# EAGLE design compteur_modifie_essence (EAGLE 9.0.0)
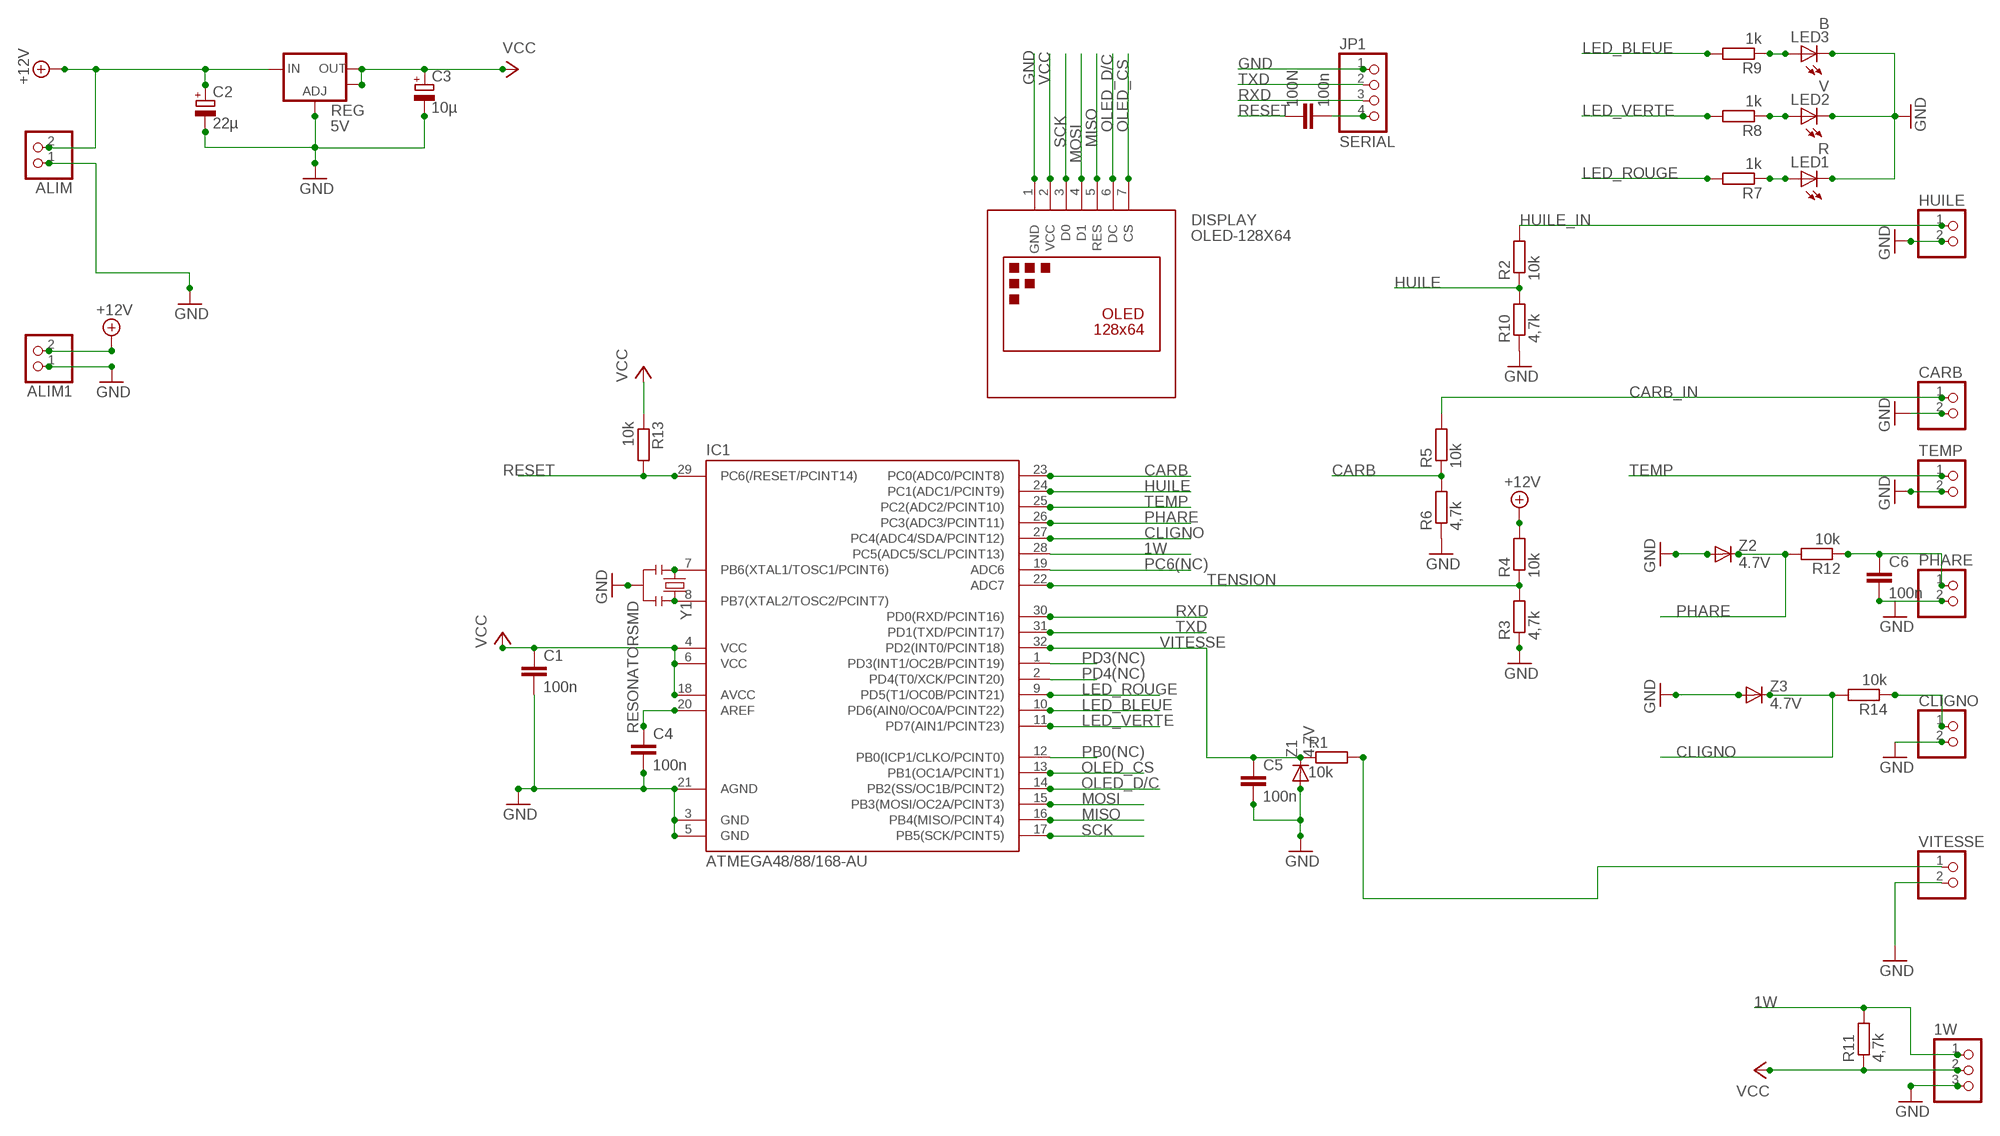
[diagram p0: schematic, sheet 1]

## Parts
1W  PINHD-1X3CB  [1X03-CLEANBIG]
100N  100n  C-EUC1206  [C1206]
ALIM  PINHD-1X2  [1X02]
ALIM1  PINHD-1X2  [1X02]
C1  100n  C-EUC1206  [C1206]
C2  22µ  CPOL-EUSMCD  [SMC_D]
C3  10µ  CPOL-EUSMCC  [SMC_C]
C4  100n  C-EUC1206  [C1206]
C5  100n  C-EUC1206  [C1206]
C6  100n  C-EUC1206  [C1206]
CARB  PINHD-1X2  [1X02]
CLIGNO  PINHD-1X2  [1X02]
DISPLAY  OLED-128X64  DISPLAY-OLED-128X64  [DISPLAY-OLED-128X64]
HUILE  PINHD-1X2  [1X02]
IC1  ATMEGA48/88/168-AU  [TQFP32-08]
JP1  SERIAL  HEADER-1X4ROUND  [1X04_ROUND]
LED1  R  LED5MM  [LED5MM]
LED2  V  LED5MM  [LED5MM]
LED3  B  LED5MM  [LED5MM]
PHARE  PINHD-1X2  [1X02]
R1  10k  R-EU_R1206  [R1206]
R2  10k  R-EU_R1206  [R1206]
R3  4,7k  R-EU_R1206  [R1206]
R4  10k  R-EU_R1206  [R1206]
R5  10k  R-EU_R1206  [R1206]
R6  4,7k  R-EU_R1206  [R1206]
R7  1k  R-EU_R1206  [R1206]
R8  1k  R-EU_R1206  [R1206]
R9  1k  R-EU_R1206  [R1206]
R10  4,7k  R-EU_R1206  [R1206]
R11  4,7k  R-EU_R1206  [R1206]
R12  10k  R-EU_R1206  [R1206]
R13  10k  R-EU_R1206  [R1206]
R14  10k  R-EU_R1206  [R1206]
REG  5V  V_REG_LM1117SOT223  [SOT223]
TEMP  PINHD-1X2  [1X02]
VITESSE  PINHD-1X2  [1X02]
Y1  RESONATORSMD  [RESONATOR-SMD]
Z1  4.7V  DIODE-SOD123  [SOD123]
Z2  4.7V  DIODE-SOD123  [SOD123]
Z3  4.7V  DIODE-SOD123  [SOD123]

## Nets
1W: 1W.1 IC1.28(PC5(ADC5/SCL/PCINT13)) R11.2
+12V: ALIM1.2 ALIM.2 C2.+ R4.2 REG.3(IN)
AREF: C4.1 IC1.20(AREF)
CARB: IC1.23(PC0(ADC0/PCINT8)) R5.1 R6.2
CARB_IN: CARB.1 R5.2
CLIGNO: IC1.27(PC4(ADC4/SDA/PCINT12)) R14.2 Z3.C
GND: 1W.3 ALIM1.1 ALIM.1 C1.2 C2.- C3.- C4.2 C5.2 C6.2 CARB.2 CLIGNO.2 DISPLAY.1(GND) HUILE.2 IC1.3(GND) IC1.5(GND) IC1.21(AGND) JP1.1 LED1.K(C) LED2.K(C) LED3.K(C) PHARE.2 R3.1 R6.1 R10.1 REG.1(ADJ) TEMP.2 VITESSE.2 Y1.2 Z1.A Z2.A Z3.A
HUILE: IC1.24(PC1(ADC1/PCINT9)) R2.1 R10.2
HUILE_IN: HUILE.1 R2.2
LED_BLEUE: IC1.10(PD6(AIN0/OC0A/PCINT22)) R9.2
LED_ROUGE: IC1.9(PD5(T1/OC0B/PCINT21)) R7.2
LED_VERTE: IC1.11(PD7(AIN1/PCINT23)) R8.2
MISO: DISPLAY.5(RES) IC1.16(PB4(MISO/PCINT4))
MOSI: DISPLAY.4(D1) IC1.15(PB3(MOSI/OC2A/PCINT3))
N$4: LED1.A R7.1
N$7: CLIGNO.1 R14.1
OLED_CS: DISPLAY.7(CS) IC1.13(PB1(OC1A/PCINT1))
OLED_D/C: DISPLAY.6(DC) IC1.14(PB2(SS/OC1B/PCINT2))
PB0(NC): IC1.12(PB0(ICP1/CLKO/PCINT0))
PC6(NC): IC1.19(ADC6)
PD3(NC): IC1.1(PD3(INT1/OC2B/PCINT19))
PD4(NC): IC1.2(PD4(T0/XCK/PCINT20))
PHARE: IC1.26(PC3(ADC3/PCINT11)) R12.2 Z2.C
PHARE_IN: C6.1 PHARE.1 R12.1
R8: LED2.A R8.1
R9: LED3.A R9.1
RESET: 100N.1 IC1.29(PC6(/RESET/PCINT14)) R13.2
RST: 100N.2 JP1.4
RXD: IC1.30(PD0(RXD/PCINT16)) JP1.3
SCK: DISPLAY.3(D0) IC1.17(PB5(SCK/PCINT5))
TEMP: IC1.25(PC2(ADC2/PCINT10)) TEMP.1
TENSION: IC1.22(ADC7) R3.2 R4.1
TXD: IC1.31(PD1(TXD/PCINT17)) JP1.2
VCC: 1W.2 C1.1 C3.+ DISPLAY.2(VCC) IC1.4(VCC) IC1.6(VCC) IC1.18(AVCC) R11.1 R13.1 REG.2(OUT) REG.4(OUT)
VITESS_IN: R1.2 VITESSE.1
VITESSE: C5.1 IC1.32(PD2(INT0/PCINT18)) R1.1 Z1.C
XTAL1: IC1.7(PB6(XTAL1/TOSC1/PCINT6)) Y1.1
XTAL2: IC1.8(PB7(XTAL2/TOSC2/PCINT7)) Y1.3

## Library data of the parts
1W = ADAFRUITmodified:PINHD-1X3: PIN HEADER
100N C1 C4-C6 = rcl:C-EU: CAPACITOR, European symbol
ALIM ALIM1 CARB CLIGNO HUILE PHARE TEMP VITESSE = pinhead:PINHD-1X2: PIN HEADER
C2 = resistor:CPOL-EU: POLARIZED CAPACITOR, European symbol
C3 = rcl:CPOL-EU: POLARIZED CAPACITOR, European symbol
DISPLAY = diy-modules:DISPLAY-OLED-128X64: 128x64 Dot Matrix OLED Module based on SSD1306 chip Variant with SPI interface More details available here: http://www.instructables.com/id/How-to-use-OLED-display-arduino-module/ SSD1306 datasheet: https://cdn-shop.adafruit.com/datasheets/SSD1306.pdf Click here to find device on ebay.com <http://www.ebay.com/sch/oled+display+128x64> Note: There are two variants: I2C and SPI. Search for the proper version.
IC1 = atmega8:ATMEGA48/88/168
JP1 = microbuilder:HEADER-1X4: PIN HEADER
LED1-LED3 = Base_CC:LED: LED OSRAM: - CHIPLED LG R971, LG N971, LY N971, LG Q971, LY Q971, LO R971, LY R971 LH N974, LH R974 LS Q976, LO Q976, LY Q976 LO Q996 - Hyper CHIPLED LW Q18S LB Q993, LB Q99A, LB R99A - SideLED LS A670, LO A670, LY A670, LG A670, LP A670 LB A673, LV A673, LT A673, LW A673 LH A674 LY A675 LS A676, LA A676, LO A676, LY A676, LW A676 LS A679, LY A679, LG A679 - Hyper Micro SIDELED® LS Y876, LA Y876, LO Y876, LY Y876 LT Y87S - SmartLED LW L88C, LW L88S LB L89C, LB L89S, LG L890 LS L89K, LO L89K, LY L89K LS L896, LA L896, LO L896, LY L896 - TOPLED LS T670, LO T670, LY T670, LG T670, LP T670 LSG T670, LSP T670, LSY T670, LOP T670, LYG T670 LG T671, LOG T671, LSG T671 LB T673, LV T673, LT T673, LW T673 LH T674 LS T676, LA T676, LO T676, LY T676, LB T676, LH T676, LSB T676, LW T676 LB T67C, LV T67C, LT T67C, LS T67K, LO T67K, LY T67K, LW E67C LS E67B, LA E67B, LO E67B, LY E67B, LB E67C, LV E67C, LT E67C LW T67C LS T679, LY T679, LG T679 LS T770, LO T770, LY T770, LG T770, LP T770 LB T773, LV T773, LT T773, LW T773 LH T774 LS E675, LA E675, LY E675, LS T675 LS T776, LA T776, LO T776, LY T776, LB T776 LHGB T686 LT T68C, LB T68C - Hyper Mini TOPLED® LB M676 - Mini TOPLED Santana® LG M470 LS M47K, LO M47K, LY M47K Source: http://www.osram.convergy.de LUXEON: - LUMILED® LXK2-PW12-R00, LXK2-PW12-S00, LXK2-PW14-U00, LXK2-PW14-V00 LXK2-PM12-R00, LXK2-PM12-S00, LXK2-PM14-U00 LXK2-PE12-Q00, LXK2-PE12-R00, LXK2-PE12-S00, LXK2-PE14-T00, LXK2-PE14-U00 LXK2-PB12-K00, LXK2-PB12-L00, LXK2-PB12-M00, LXK2-PB14-N00, LXK2-PB14-P00, LXK2-PB14-Q00 LXK2-PR12-L00, LXK2-PR12-M00, LXK2-PR14-Q00, LXK2-PR14-R00 LXK2-PD12-Q00, LXK2-PD12-R00, LXK2-PD12-S00 LXK2-PH12-R00, LXK2-PH12-S00 LXK2-PL12-P00, LXK2-PL12-Q00, LXK2-PL12-R00 Source: www.luxeon.com KINGBRIGHT: KA-3528ASYC Source: www.kingbright.com
R1-R14 = rcl:R-EU_: RESISTOR, European symbol
REG = SparkFun:V_REG_LM1117: Voltage Regulator LM1117 Standard adjustable voltage regulator but in SMD form. Spark Fun Electronics SKU : COM-00595
Y1 = SparkFun:RESONATOR: Resonator Small SMD resonator. This is the itty bitty 10/20MHz resonators with built in caps. CSTCE10M0G55 and CSTCE20M0V53. Footprint has been reviewed closely but hasn't been tested yet.
Z1-Z3 = diode:DIODE-: DIODE

## Board
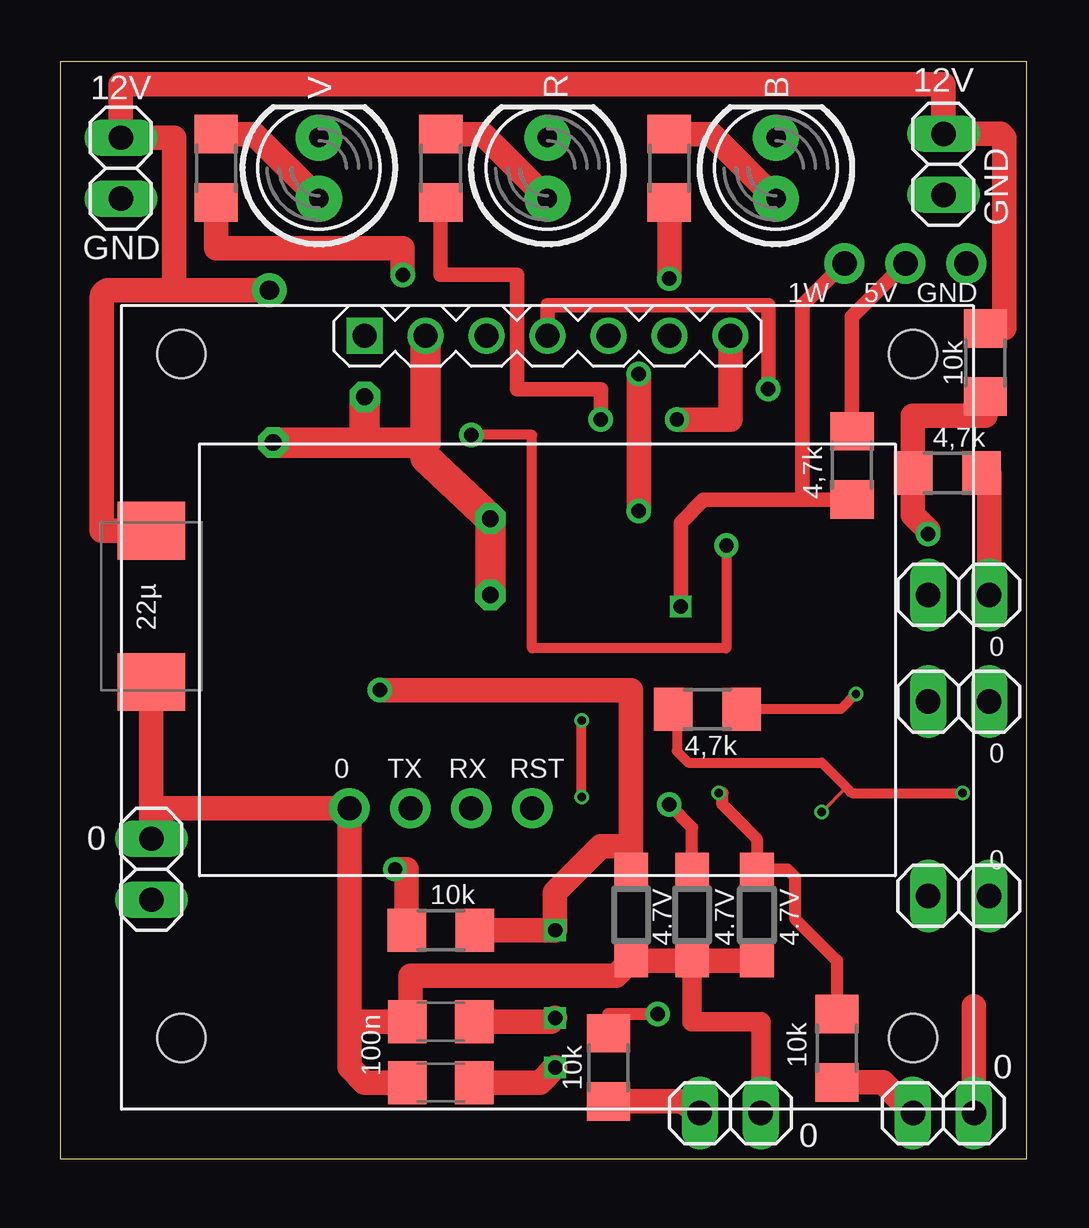
[diagram p1: board, top side]
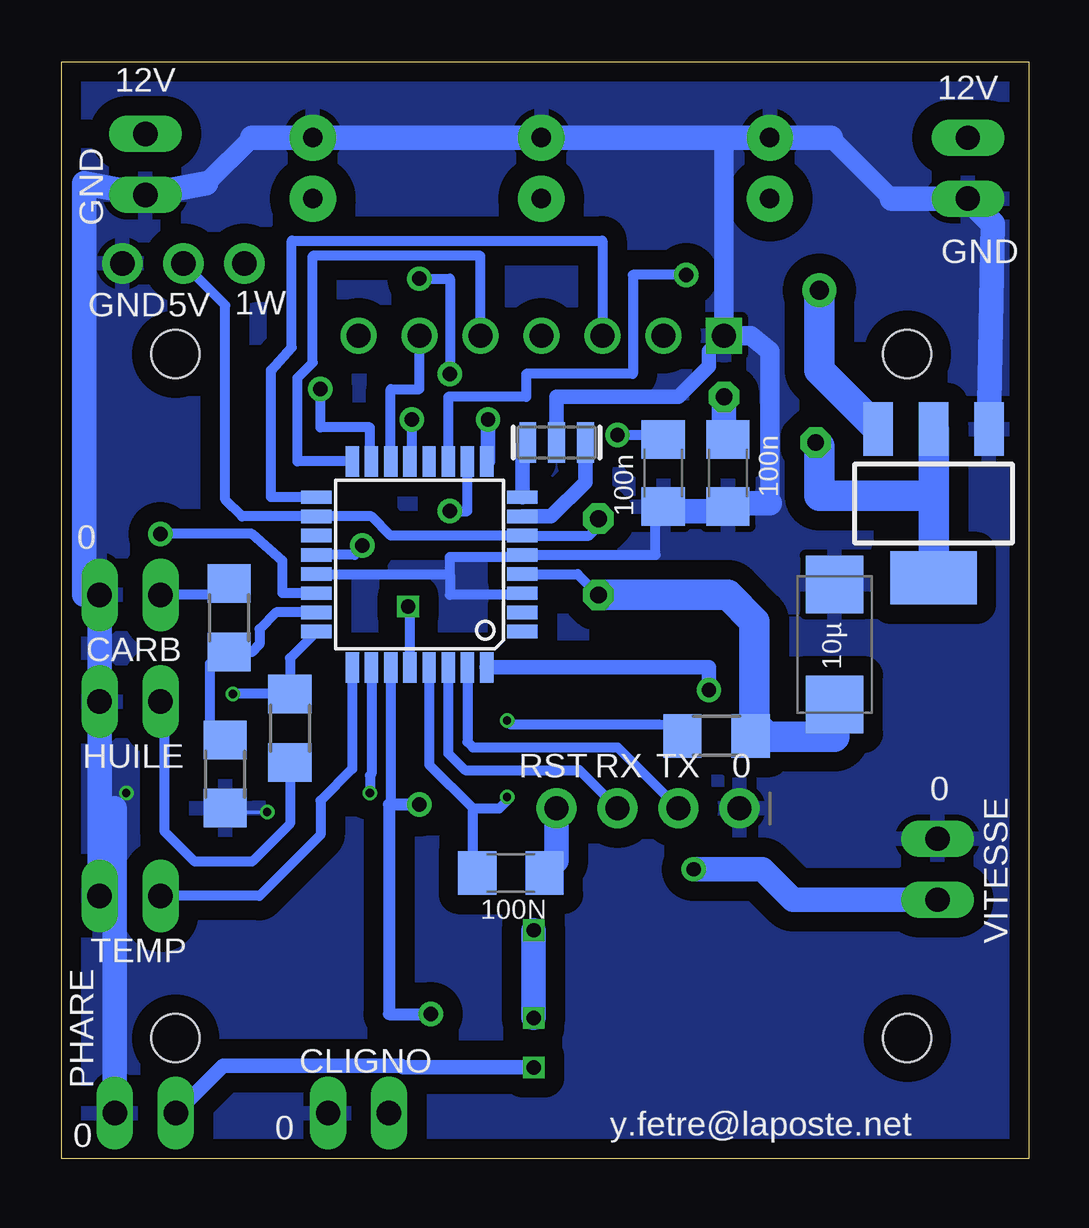
[diagram p2: board, bottom side, seen from below]

Size 40.31 x 45.71 mm. Coordinates in mm from the lower left corner, seen from the top.
Outline: 0,0 40.31,0 40.31,45.71 0,45.71 0,0
Copper layers (1*16): Top 0.035559375mm / dielectric 1.6mm / Bottom 0.035559375mm
Design rules "oshpark-2layer": minimum track width 6mil, minimum drill 10mil, track to track 6mil, track to pad 6mil, pad to pad 6mil, via to via 6mil, smd to smd 6mil, copper to edge 15mil, drill to drill 6mil, minimum pad ring 5mil, minimum via ring 5mil, stop-mask expansion 2.5mil, vias tented up to drill 0mil, thermal gap 10mil

### Footprints (pad centres in the part's own frame; a part is rotated, then mirrored left to right if it is on the bottom)
1X03-CLEANBIG = drill 1.016 pad 1.676: 1 -2.54,0; 2 0,0; 3 2.54,0
C1206 = smd 1.6 x 1.8: 1 -1.4,0; 2 1.4,0
1X02 = drill 1.016 long: 1 -1.27,0; 2 1.27,0
SMC_D = smd 2.4 x 2.8: + -3.15,0; - 3.15,0
SMC_C = smd 2.4 x 2.4: + -2.5,0; - 2.5,0
DISPLAY-OLED-128X64 = drill 1 square: 1 -7.62,12.7 | drill 1: 2 -5.08,12.7; 3 -2.54,12.7; 4 0,12.7; 5 2.54,12.7; 6 5.08,12.7; 7 7.62,12.7 | hole 2: -15.25,11.938; 15.25,11.938; 15.25,-16.562; -15.25,-16.562
TQFP32-08 = smd 1.27 x 0.559: 1 -4.293,2.8; 2 -4.293,2; 3 -4.293,1.2; 4 -4.293,0.4; 5 -4.293,-0.4; 6 -4.293,-1.2; 7 -4.293,-2; 8 -4.293,-2.8; 17 4.293,-2.8; 18 4.293,-2; 19 4.293,-1.2; 20 4.293,-0.4; 21 4.293,0.4; 22 4.293,1.2; 23 4.293,2; 24 4.293,2.8 | smd 0.559 x 1.27: 9 -2.8,-4.293; 10 -2,-4.293; 11 -1.2,-4.293; 12 -0.4,-4.293; 13 0.4,-4.293; 14 1.2,-4.293; 15 2,-4.293; 16 2.8,-4.293; 25 2.8,4.293; 26 2,4.293; 27 1.2,4.293; 28 0.4,4.293; 29 -0.4,4.293; 30 -1.2,4.293; 31 -2,4.293; 32 -2.8,4.293
1X04_ROUND = drill 1 pad 1.676: 1 -3.81,0; 2 -1.27,0; 3 1.27,0; 4 3.81,0
LED5MM = drill 0.813 pad 1.93: A -1.27,0; K 1.27,0
R1206 = smd 1.6 x 1.803: 1 -1.422,0; 2 1.422,0
SOT223 = smd 1.219 x 2.235: 1 -2.311,-3.099; 2 0,-3.099; 3 2.311,-3.099 | smd 3.6 x 2.2: 4 0,3.099
RESONATOR-SMD = smd 0.7 x 1.7: 1 -1.2,0; 2 0,0; 3 1.2,0
SOD123 = smd 1.4 x 1.4: A 1.9,0; C -1.9,0

### Placement (x,y rotation side)
1W  35.24,37.31 0 top
100N  21.59,11.91 0 bottom
ALIM  2.54,41.27 90 top
ALIM1  36.83,41.43 90 top
C1  12.54,28.58 270 bottom
C2  3.81,23.02 270 top
C3  8.1,21.43 90 bottom
C4  15.24,28.58 270 bottom
C5  15.87,5.72 180 top
C6  15.87,3.18 180 top
CARB  37.47,23.49 0 top
CLIGNO  27.94,1.91 0 top
DISPLAY  20.32,21.59 0 top
HUILE  37.47,19.05 0 top
IC1  25.4,24.77 180 bottom
JP1  15.87,14.61 180 bottom
LED1  20.32,41.27 90 top
LED2  10.79,41.27 90 top
LED3  29.84,41.27 90 top
PHARE  36.83,1.91 0 top
R1  15.87,9.52 180 top
R2  30.8,17.94 270 bottom
R3  36.99,28.58 180 top
R4  38.58,33.18 90 top
R5  33.34,22.54 90 bottom
R6  33.5,16.03 90 bottom
R7  15.87,41.27 270 top
R8  6.51,41.27 270 top
R9  25.4,41.27 270 top
R10  26.99,18.73 0 top
R11  33.02,28.89 270 top
R12  32.39,4.6 90 top
R13  13.02,17.62 180 bottom
R14  22.86,3.81 90 top
REG  3.97,27.3 180 bottom
TEMP  37.47,10.95 0 top
VITESSE  3.81,12.06 90 top
Y1  19.68,29.85 180 bottom
Z1  23.81,10.16 270 top
Z2  29.05,10.16 270 top
Z3  26.35,10.16 270 top

### Tracks (layer width: path | path; a pad name or v marks a point on that pad's centre or on a via)
1W  (via drill 0.6)
  Top 0.61: 1W.1 30.96,35.56 30.96,27.46 | R11.2 33.34,27.36 33.24,27.46 30.96,27.46 | v25.88,23.02 25.88,26.51 26.83,27.46 30.96,27.46
  Bottom 0.406: IC1.28 25.8,23.1 25.88,23.18 v25.88,23.02
+12V  (via drill 0.8 pad 1.42)
  Top 1.016: 4.76,36.2 4.76,42.54 ALIM.2 2.54,44.77 36.83,44.77 ALIM1.2 39.21,42.7 39.37,42.54 39.37,36.83 39.36,34.6 R4.2 | C2.+ 1.75,26.17 1.75,35.88 arc-90 2.06,36.2 4.76,36.2 | 4.76,36.2 v8.73,36.2
  Bottom 0.813: REG.3 6.35,30.48 6.35,30.47 REG.3
  Bottom 1.27: 6.35,30.48 8.73,32.86 v8.73,36.2
AREF  (via drill 0.6 pad 1.02)
  Top 0.406: v27.78,25.56 27.78,21.27 19.68,21.27 19.68,30.16 v17.14,30.16
  Bottom 0.305: 16.06,30.16 C4.1 15.87,30.16
  Bottom 0.406: IC1.20 28.1,25.16 v27.78,25.56 | v17.14,30.16 15.87,30.16
CARB
  Bottom 0.406: IC1.23 31.37,22.77 32.07,22.07 32.07,21.43 32.39,21.11 R5.1 | R5.1 33.5,20.96 | R6.2 33.66,17.62 34.13,17.62 34.13,20.64 33.65,21.12 R5.1
CARB_IN
  Bottom 0.406: R5.2 33.81,23.49 CARB.1
CLIGNO  (via drill 0.6 pad 1.02)
  Top 0.305: 22.86,5.4 R14.2
  Top 0.508: v24.92,6.03 22.86,6.03 22.86,5.4 | Z3.C 26.35,13.81 v25.4,14.76
  Bottom 0.406: IC1.27 26.6,14.83 26.67,14.76
  Bottom 0.508: v25.4,14.76 26.67,14.76 26.67,6.03 v24.92,6.03
GND  (via drill 0.35)
  Top 0.152: 32.78,15.48 v31.75,14.45
  Top 0.406: 14.45,5.69 C5.2 14.61,5.84 | R10.1 25.72,18.58 25.72,16.99 26.19,16.51 31.75,16.51 32.78,15.48 33.02,15.24 v37.62,15.24
  Top 0.813: Z3.A 26.35,5.72 29.21,5.72 CLIGNO.2 | 23.83,8.28 Z1.A
  Top 1.016: R3.1 38.73,28.57 CARB.2 | VITESSE.2 3.81,14.61 | 3.81,14.61 JP1.1 12.07,5.72 | 12.07,5.72 C5.2 | 14.61,5.84 14.61,7.62 23.18,7.62 23.83,8.28 | PHARE.2 38.1,6.35 | 3.81,14.61 C2.- | 12.07,5.72 12.07,3.81 12.7,3.18 C6.2 | Z1.A Z3.A Z2.A
  Bottom 0.152: v31.75,14.45 33.33,14.45 R6.1
  Bottom 0.305: IC1.3 21.18,23.49 | 21.11,25.08 IC1.5 | C4.2 15.56,26.99 | 12.7,26.99 C1.2 12.57,27.3
  Bottom 0.406: 21.18,23.49 24.13,23.49 24.13,24.34 | 24.13,24.34 24.13,25.08 21.11,25.08 | IC1.5 15.56,25.16 15.56,26.99 | IC1.21 24.15,24.37 24.13,24.34
  Bottom 0.61: Y1.2 19.68,31.75 14.61,31.75 13.33,33.02 13.33,33.65 DISPLAY.1
  Bottom 0.813: TEMP.2 38.1,14.61 | 32.39,42.54 34.29,40.64 | 8.25,42.54 5.71,40.01 | 39.37,23.49 CARB.2 | 12.7,42.54 DISPLAY.1 11.59,34.29 10.79,33.65 10.79,27.3
  Bottom 1.016: CARB.2 HUILE.2 TEMP.2 | 38.1,14.61 PHARE.2 38.1,0.95 | REG.1 1.5,38.96 ALIM.1 5.71,40.01 | 32.39,42.54 LED3.K LED1.K 12.7,42.54 LED2.K 8.25,42.54 | 34.29,40.64 ALIM1.1 39.37,40.64 39.37,23.49 | 15.56,26.99 12.7,26.99 | 10.79,27.3 12.57,27.3
  pour Bottom (isolate 0.813): 0.32,45.24 39.85,45.24 39.85,0.48 0.32,0.48 0.32,45.09
HUILE  (via drill 0.35)
  Top 0.406: v33.18,19.37 32.54,18.73 R10.2
  Bottom 0.406: IC1.24 30.8,20.86 R2.1 v33.18,19.37
HUILE_IN
  Bottom 0.152: HUILE.1 36.04,18.89
  Bottom 0.406: HUILE.1 36.2,18.26 35.88,17.94 | R2.2 30.8,13.97 32.39,12.38 34.77,12.38 36.04,13.65 36.04,18.89
LED_BLEUE  (via drill 0.6 pad 1.02)
  Top 1.016: R9.2 v25.4,36.67 | v24.13,32.7 v24.13,26.99
  Bottom 0.406: v25.4,36.67 24.13,36.67 v24.13,32.7 | v24.13,26.99 23.4,26.99 IC1.10
LED_ROUGE  (via drill 0.6 pad 1.02)
  Top 0.61: v22.54,30.8 22.54,32.07 19.05,32.07 19.05,36.83 15.87,36.83 R7.2 15.87,40.01
  Bottom 0.305: IC1.9 22.54,29.06
  Bottom 0.61: 22.54,29.06 v22.54,30.8
LED_VERTE  (via drill 0.6 pad 1.02)
  Top 1.016: R8.2 6.51,37.94 14.29,37.94 v14.29,36.83
  Bottom 0.406: v14.29,36.83 16.51,36.83 16.51,32.7 20.96,32.7 20.96,31.75 24.2,31.75 IC1.11
MISO
  Bottom 0.406: DISPLAY.5 22.86,37.62 29.84,37.62 29.84,33.18 30.48,32.54 30.48,29.06 IC1.16
MOSI  (via drill 0.6 pad 1.02)
  Top 0.61: DISPLAY.4 20.32,35.56 29.53,35.56 v29.53,32.07
  Bottom 0.305: IC1.15 27.46,29.06
  Bottom 0.406: v29.53,32.07 29.53,30.48 27.46,30.48 27.46,29.06
N$4
  Top 1.016: R7.1 17.63,42.7 LED1.A
N$7
  Top 1.016: CLIGNO.1 25.88,2.39 R14.1
OLED_CS  (via drill 0.6 pad 1.02)
  Top 1.016: v25.72,30.8 27.94,30.8 DISPLAY.7
  Bottom 0.305: IC1.13 25.72,29.06
  Bottom 0.406: 25.72,29.06 v25.72,30.8
OLED_D/C
  Bottom 0.406: IC1.14 26.6,32.07 25.4,32.07 DISPLAY.6
PHARE  (via drill 0.35)
  Top 0.406: 27.62,15.24 v27.47,15.24
  Top 0.508: R12.2 32.39,8.26 30.64,10.01 30.64,11.75 30.33,12.06 Z2.C 29.05,13.34 27.62,14.76 27.62,15.24
  Bottom 0.406: v27.47,15.24 27.47,15.97 27.4,16.03 IC1.26
PHARE_IN  (via drill 0.6)
  Top 1.016: PHARE.1 34.3,3.18 R12.1 | v20.64,3.81 20,3.18 C6.1
  Bottom 0.61: v20.64,3.81 26.09,3.81 26.16,3.89 33.58,3.89 PHARE.1
R8
  Top 1.016: R8.1 8.1,42.7 LED2.A
R9
  Top 1.016: R9.1 27.15,42.7 LED3.A
RESET  (via drill 0.35)
  Top 0.406: v21.75,15.08 v21.75,18.26
  Bottom 0.406: 23.18,14.61 25,16.43 IC1.29 | 23.18,12.09 23.18,14.61 | 23.18,14.61 22.07,14.61 21.75,14.92 v21.75,15.08 | v21.75,18.26 21.59,18.1 15.4,18.1 14.76,18.09 R13.2
  Bottom 1.016: 100N.1 23.18,12.09
RST
  Bottom 1.016: 100N.2 19.68,12.41 JP1.4
RXD
  Bottom 0.406: IC1.30 24.2,16.9 23.5,16.19 18.73,16.19 JP1.3
SCK
  Bottom 0.406: IC1.17 31.59,27.56 31.59,32.86 30.72,33.81 30.72,38.26 17.78,38.26 DISPLAY.3
TEMP
  Bottom 0.305: 28.26,20.47 IC1.25
  Bottom 0.406: IC1.25 28.2,16.25 29.53,14.92 29.53,13.49 32.07,10.95 TEMP.1
TENSION  (via drill 0.6 pad 1.02)
  Top 0.406: 35.56,29.36 R3.2 35.56,28.57 | 36.2,26.19 v36.2,26.04
  Top 1.016: R4.1 38.58,30.96 35.56,30.96 35.56,29.36 | 35.56,28.57 35.56,26.83 36.2,26.19
  Bottom 0.406: v36.2,26.04 32.39,26.04 31.11,24.92 31.11,23.56 IC1.22
TXD
  Bottom 0.406: IC1.31 23.4,17.37 23.18,17.15 17.14,17.15 JP1.2
VCC  (via drill 0.7 pad 1.27)
  Top 0.61: R11.1 33.02,35.08 1W.2
  Top 0.813: 15.24,29.85 15.24,29.21
  Top 1.27: v17.94,23.49 v17.94,26.67 15.24,29.21 | v8.89,29.85 12.7,29.85 | 12.7,29.85 15.24,29.85 DISPLAY.2 | v12.7,31.75 12.7,29.85
  Bottom 0.152: R13.1 10.95,17.62 10.92,17.59
  Bottom 0.305: 8.81,29.76 v8.89,29.85
  Bottom 0.406: IC1.4 18.81,24.37 v17.94,23.49 | IC1.18 27.4,26.77 26.6,25.97 IC1.6 18.33,25.97 17.94,26.35 v17.94,26.67 | 29.76,26.83 IC1.18 | 1W.2 33.5,35.56 33.5,27.46 32.8,26.77 IC1.18
  Bottom 0.813: C1.1 12.7,29.98 | 3.97,27.46 4.13,27.62
  Bottom 1.016: 12.7,29.98 v12.7,31.75
  Bottom 1.27: C3.+ 8.1,17.59 10.92,17.59 11.43,18.1 11.43,22.38 12.54,23.49 v17.94,23.49 | REG.4 3.97,27.46 REG.2 | 4.13,27.62 8.73,27.62 8.73,29.69 v8.89,29.85
VITESS_IN  (via drill 0.6 pad 1.02)
  Top 1.016: R1.2 14.45,12.06 v13.97,12.06
  Bottom 1.016: v13.97,12.06 11.11,12.06 9.84,10.8 VITESSE.1
VITESSE  (via drill 0.6, 0.6 pad 1.02)
  Top 0.61: 23.65,13.02 Z1.C
  Top 1.016: Z1.C 23.81,19.53 v13.33,19.53 | v20.64,5.87 20.48,5.72 C5.1 | R1.1 v20.64,9.52 20.64,11.11 22.54,13.02 23.65,13.02
  Bottom 0.61: IC1.32 13.33,20.47 v13.33,19.53
  Bottom 1.016: v20.64,5.87 v20.64,9.52
XTAL1
  Bottom 0.61: IC1.7 19.91,26.77 18.48,28.19 Y1.1
XTAL2
  Bottom 0.305: 21.11,29.69 20.96,29.85 Y1.3
  Bottom 0.61: IC1.8 21.11,29.69

### Text on the board
tNames: 12V | 12V | GND | GND | 1W | 5V | GND | 0 | 0 | 0 | TX | RX | RST | 0 | 0 | 4.7V | 4.7V | 0 | 0
bNames: 12V | 12V | GND | GND | 5V | GND | 0 | 0 | TX | RX | RST | 0 | y.fetre@laposte.net | 0 | 0